# Altium schematic sheet U_I_Meter_Bottom.SchDoc
size A2; SheetNumber: 1; SheetTotal: 1; SPICEModelCacheKLKQCPMB: <root> / <DocumentId>KLKQCPMB</DocumentId> / </root>
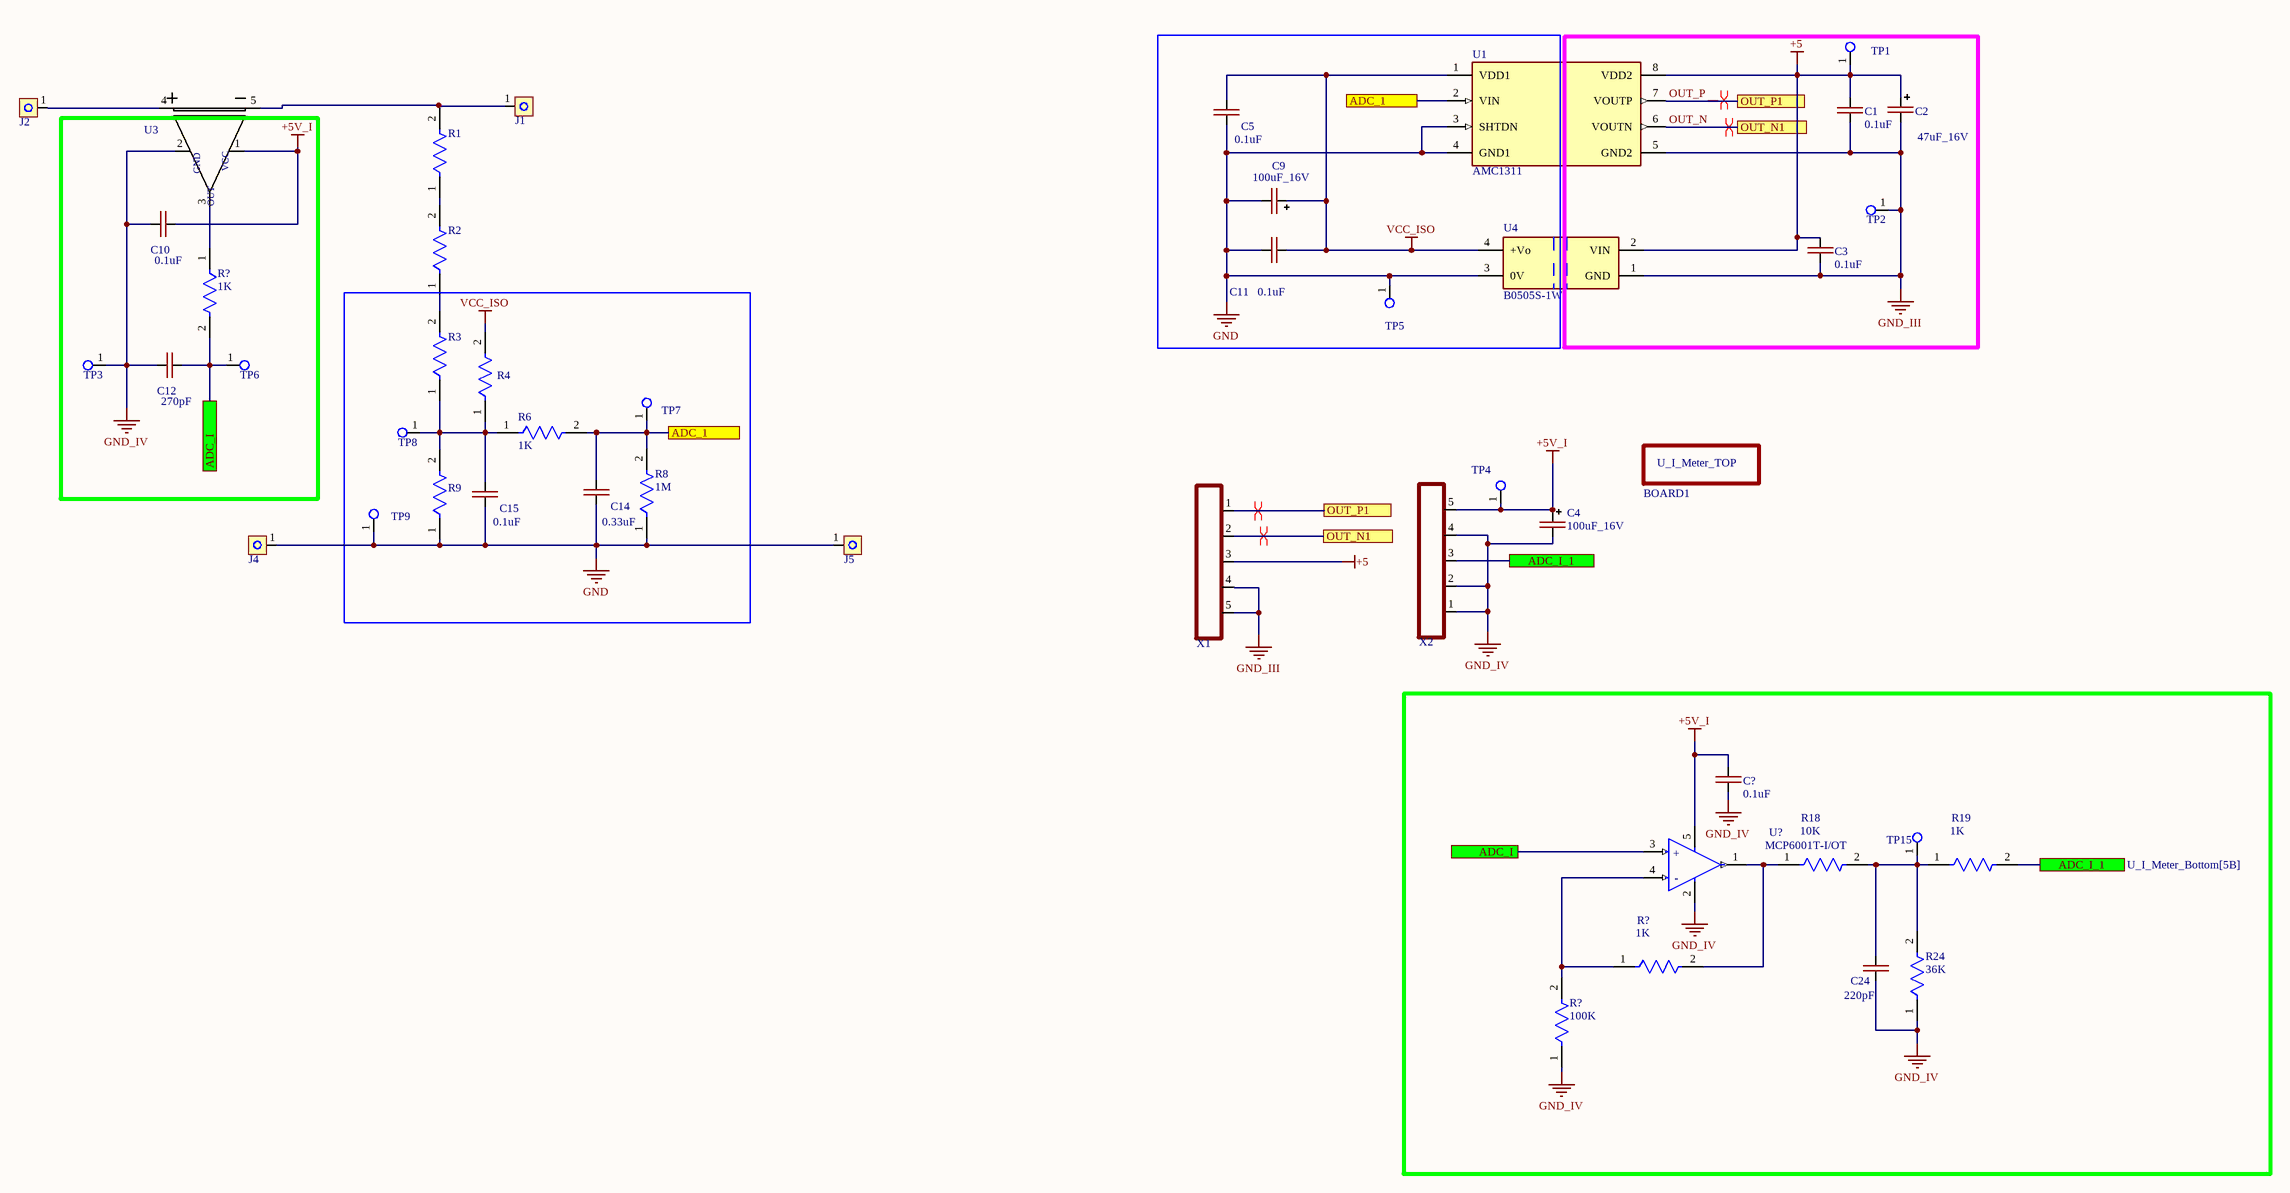
[diagram p0: U_I_Meter_Bottom.SchDoc]

## Parts
(Parts that share a designator on the sheet are numbered #1, #2 ... from top to bottom, then left to right.)
BOARD1  U_I_Meter_TOP  [U_I_Meter_TOP]  (value not drawn)
C1  0.1uF  [CAP-0805]
C2  47uF_16V  [CAP-TAN-D]
C3  0.1uF  [CAP-0805]
C4  100uF_16V  [CAP-TAN-D]
C5  0.1uF  [CAP-0805]
C9  100uF_16V  [CAP-TAN-D]
C10  0.1uF  [CAP-0805]
C11  0.1uF  [CAP-0805]
C12  270pF  [CAP-0805]
C14  0.33uF  [CAP-0805]
C15  0.1uF  [CAP-0805]
C24  220pF  [CAP-0805]
C?  0.1uF  [CAP-0805]
J1  MG_136_HT  [Conn_MEIGAN_MG136HT]  (value not drawn)
J2  MG_136_HT  [Conn_MEIGAN_MG136HT]  (value not drawn)
J4  MG_136_HT  [Conn_MEIGAN_MG136HT]  (value not drawn)
J5  MG_136_HT  [Conn_MEIGAN_MG136HT]  (value not drawn)
R1  (no value)  [RES-2512]
R2  (no value)  [RES-2512]
R3  (no value)  [RES-2512]
R4  (no value)  [RES-0805]
R6  1K  [RES-0805]
R8  1M  [RES-0805]
R9  RES_1210  [RES_SMD_1210_IPC_B]  (value not drawn)
R18  10K  [RES-0805]
R19  1K  [RES-0805]
R24  36K  [RES-0805]
R?#1  1K  [RES-0805]
R?#2  1K  [RES-0805]
R?#3  100K  [RES-0805]
TP1  Test_Point_PCB  [Test_Point]  (value not drawn)
TP2  Test_Point_PCB  [Test_Point]  (value not drawn)
TP3  Test_Point_PCB  [Test_Point]  (value not drawn)
TP4  Test_Point_PCB  [Test_Point]  (value not drawn)
TP5  Test_Point_PCB  [Pin_Test_Point(Pink)]  (value not drawn)
TP6  Test_Point_PCB  [Test_Point]  (value not drawn)
TP7  Test_Point_PCB  [Test_Point]  (value not drawn)
TP8  Test_Point_PCB  [Test_Point]  (value not drawn)
TP9  Test_Point_PCB  [Test_Point]  (value not drawn)
TP15  Test_Point_PCB  [Test_Point]  (value not drawn)
U1  AMC1311  [FP-DWV0008A-MFG]
U3  ACS758  [ACS758-100]  (value not drawn)
U4  B0505S-1W  [B0505S-1W]
U?  MCP6001T-I/OT  [SOT-23-5]
X1  CONN-5-PIN  [CONN-PLS-5-2.54mm]  (value not drawn)
X2  CONN-5-PIN  [CONN-PLS-5-2.54mm]  (value not drawn)

## Ports
ADC_1 (see U_I_Meter_Bottom[3A]), ADC_1 (see U_I_Meter_Bottom[4A]), ADC_I (see U_I_Meter_Bottom[1A]), ADC_I (see U_I_Meter_Bottom[5B]), ADC_I_1 (see U_I_Meter_Bottom[5B]), ADC_I_1 (see U_I_Meter_Bottom[6B]), OUT_N1 (see U_I_Meter_Bottom[4B]), OUT_N1 (see U_I_Meter_Bottom[5A]), OUT_P1 (see U_I_Meter_Bottom[4B]), OUT_P1 (see U_I_Meter_Bottom[5A])

## Nets
+5: C1.1 C2.1(+) C3.1 TP1.1(G9) U1.8(VDD2) U4.2(VIN) X1.3
+5V_I: C4.1(+) C10.2 C?.2 TP4.1(G9) U3.1(+VCC) U?.5(VDD) X2.5
GND: C5.1 C9.2(-) C11.2 C14.1 C15.1 J4.1 J5.1 R8.1 R9.1 TP5.1(G9) TP9.1(G9) U1.3(SHTDN) U1.4(GND1) U4.3(0V)
GND_III: C1.2 C2.2(-) C3.2 TP2.1(G9) U1.5(GND2) U4.1(GND) X1.4 X1.5
GND_IV: C4.2(-) C10.1 C12.1 C24.1 C?.1 R24.1 R?#3.1 TP3.1(G9) U3.2(GND) U?.2(VSS) X2.1 X2.2 X2.4
VCC_ISO: C5.2 C9.1(+) C11.1 R4.2 U1.1(VDD1) U4.4(+Vo)
ADC_1: C14.2 R6.2 R8.2 TP7.1(G9) U1.2(VIN) ; port ADC_1
ADC_I: C12.2 R?#1.2 TP6.1(G9) U?.3(VIN+) ; port ADC_I
ADC_I_1: R19.2 X2.3 ; port ADC_I_1
OUT_N: U1.6(VOUTN) X1.2 ; port OUT_N1
OUT_P: U1.7(VOUTP) X1.1 ; port OUT_P1
NetC15_2: C15.2 R3.1 R4.1 R6.1 R9.2 TP8.1(G9)
NetC24_2: C24.2 R18.2 R19.1 R24.2 TP15.1(G9)
NetJ1_1: J1.1 R1.2 U3.5(-IP)
NetJ2_1: J2.1 U3.4(+IP)
NetR1_1: R1.1 R2.2
NetR2_1: R2.1 R3.2
NetR18_1: R18.1 R?#2.2 U?.1(VOUT)
NetR?#1_1: R?#1.1 U3.3(OUT)
NetR?#2_1: R?#2.1 R?#3.2 U?.4(VIN-)

## Layout directives
differential pair: (no net found under the mark), OUT_N, OUT_P

## Notes on the sheet
- (in symbol ACS758) VCC
- (in symbol MCP6001T) +; -

## Library data of the parts
C1 C3 C5 C10-C12 C14 C15 C24 C? = CAP-NON-POLAR
C2 = CAP-POLAR
C4 C9 = CAP_POL_SMD
J1 J2 J4 J5 = Connector_MEIGAN_MG136HT
R1-R4 R6 R8 R18 R24 R?#1 R?#3 = RES-CONST
R19 R?#2 = RES-CONST: 10K
TP1-TP9 TP15 = TP_PCB?: Test_Point
U? = MCP6001T: IC OPAMP GP 1 CIRCUIT SOT23-5; Number of Amplifiers: 1; Voltage: 6V; Power Supply Rejection Ratio (PSRR): 86dB; Common Mode Rejection Ratio: 60dB; Unity Gain Bandwidth Product: 1MHz; Slew Rate: 0.6V/µs; Output Current per Channel: 23mA; Nominal Supply Current: 100uA; Input Offset Voltage (Vos): 4.5mV; Input Bias Current: 1pA; Operating Supply Voltage: 5.5V; Min Supply Voltage: 1.8V; Voltage Gain: 112dB; Length: 3.1mm; REACH SVHC: No SVHC; Number of Pins: 5; Package Quantity: 1; Radiation Hardening: No; Mount: Surface Mount; Number of Circuits: 1; Number of Elements: 1; Output Current: 23mA; Packaging: Tape and Reel; Height: 1.3mm; Lead Free: Lead Free; Min Operating Temperature: -40°C; Bandwidth: 1MHz; Contact Plating: Tin; Max Supply Voltage: 6V; Max Operating Temperature: 85°C; Width: 1.8mm; Case/Package: SOT-23; Operating Supply Current: 100uA; Number of Channels: 1; Gain Bandwidth Product: 1MHz